# EAGLE design mLRS-E28-board01-v004 (EAGLE 7.5.0)
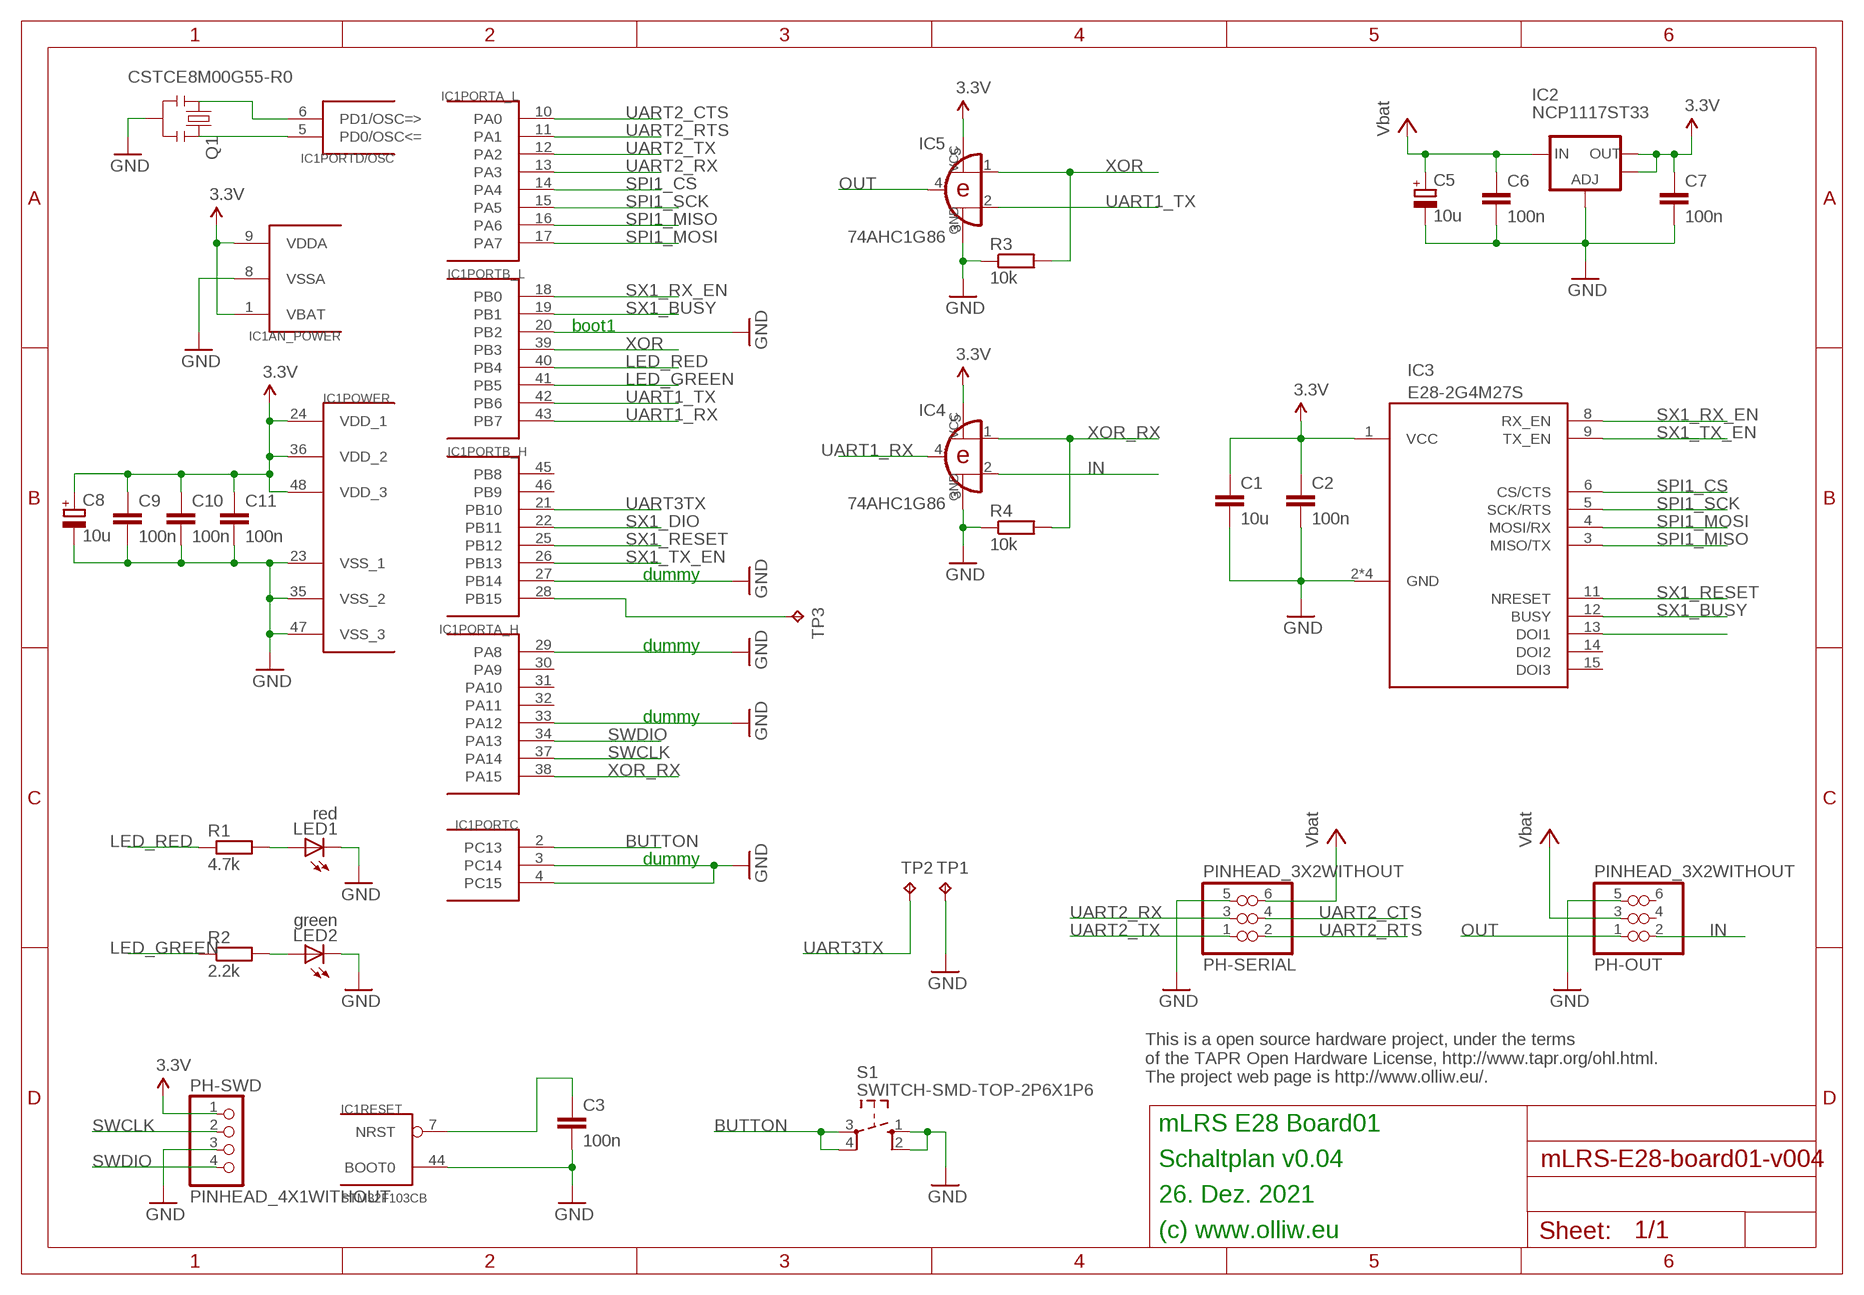
[diagram p0: schematic, sheet 1]

## Parts
C1  10u  C-EUC0603  [C0603]
C2  100n  C-EUC0402  [C0402]
C3  100n  C-EUC0603  [C0603]
C5  10u  CPOL-EUSMCA  [SMC_A]
C6  100n  C-EUC0603  [C0603]
C7  100n  C-EUC0603  [C0603]
C8  10u  CPOL-EUSMCA  [SMC_A]
C9  100n  C-EUC0603  [C0603]
C10  100n  C-EUC0603  [C0603]
C11  100n  C-EUC0603  [C0603]
IC1  STM32F103CB  STM32F10XCXT6  [TQFP48]
IC2  NCP1117ST33  V_REG_LM1117SOT223  [SOT223]
IC3  E28-2G4M27S  E28  [E28-2G4M27]
IC4  74AHC1G86  [SOT23-5-VER1]
IC5  74AHC1G86  [SOT23-5-VER1]
LED1  red  LEDCHIPLED_0603  [CHIPLED_0603]
LED2  green  LEDCHIPLED_0603  [CHIPLED_0603]
PH-OUT  PINHEAD_3X2WITHOUT  [PINHEAD_3X2_WO]
PH-SERIAL  PINHEAD_3X2WITHOUT  [PINHEAD_3X2_WO]
PH-SWD  PINHEAD_4X1WITHOUT  [PINHEAD_4X1_WO]
Q1  CSTCE8M00G55-R0  RESONATORSMD  [RESONATOR-SMD]
R1  4.7k  R-EU_R0402  [R0402]
R2  2.2k  R-EU_R0402  [R0402]
R3  10k  R-EU_R0402  [R0402]
R4  10k  R-EU_R0402  [R0402]
S1  SWITCH-SMD-TOP-2P6X1P6  [TACTILE-SWITCH-SMD-TOP-2P6X1X6]
TP1  TPB1,27  [B1,27]
TP2  TPB1,27  [B1,27]
TP3  TPTP08R  [TP08R]

## Nets
3.3V: C1.1 C2.1 C7.1 C8.+ C9.1 C10.1 C11.1 IC1.1(AN_POWER:VBAT) IC1.9(AN_POWER:VDDA) IC1.24(POWER:VDD_1) IC1.36(POWER:VDD_2) IC1.48(POWER:VDD_3) IC2.2(OUT) IC2.4(OUT) IC3.1(VCC) IC4.5(VCC) IC5.5(VCC) PH-SWD.1
BUTTON: IC1.2(PORTC:PC13) S1.3 S1.4
GND: C1.2 C2.2 C3.2 C5.- C6.2 C7.2 C8.- C9.2 C10.2 C11.2 IC1.3(PORTC:PC14) IC1.4(PORTC:PC15) IC1.8(AN_POWER:VSSA) IC1.20(PORTB_L:PB2) IC1.23(POWER:VSS_1) IC1.27(PORTB_H:PB14) IC1.29(PORTA_H:PA8) IC1.33(PORTA_H:PA12) IC1.35(POWER:VSS_2) IC1.44(RESET:BOOT0) IC1.47(POWER:VSS_3) IC2.1(ADJ) IC3.2(GND) IC3.7(GND) IC3.10(GND) IC3.16(GND) IC4.3(GND) IC5.3(GND) LED1.C LED2.C PH-OUT.5 PH-SERIAL.5 PH-SWD.3 Q1.2 R3.1 R4.1 S1.1 S1.2 TP1.TP
IN: IC4.2(I1) PH-OUT.2
LED_GREEN: IC1.41(PORTB_L:PB5) R2.1
LED_RED: IC1.40(PORTB_L:PB4) R1.1
N$5: C3.1 IC1.7(RESET:NRST)
N$9: IC1.28(PORTB_H:PB15) TP3.TP
N$12: IC1.5(PORTD/OSC:PD0/OSC<=) Q1.3
N$14: IC1.6(PORTD/OSC:PD1/OSC=>) Q1.1
N$17: LED1.A R1.2
N$19: LED2.A R2.2
OUT: IC5.4(O) PH-OUT.1
SPI1_CS: IC1.14(PORTA_L:PA4) IC3.6(CS/CTS)
SPI1_MISO: IC1.16(PORTA_L:PA6) IC3.3(MISO/TX)
SPI1_MOSI: IC1.17(PORTA_L:PA7) IC3.4(MOSI/RX)
SPI1_SCK: IC1.15(PORTA_L:PA5) IC3.5(SCK/RTS)
SWCLK: IC1.37(PORTA_H:PA14) PH-SWD.2
SWDIO: IC1.34(PORTA_H:PA13) PH-SWD.4
SX1_BUSY: IC1.19(PORTB_L:PB1) IC3.12(BUSY)
SX1_DIO: IC1.22(PORTB_H:PB11) IC3.13(DOI1)
SX1_RESET: IC1.25(PORTB_H:PB12) IC3.11(NRESET)
SX1_RX_EN: IC1.18(PORTB_L:PB0) IC3.8(RX_EN)
SX1_TX_EN: IC1.26(PORTB_H:PB13) IC3.9(TX_EN)
UART1_RX: IC1.43(PORTB_L:PB7) IC4.4(O)
UART1_TX: IC1.42(PORTB_L:PB6) IC5.2(I1)
UART2_CTS: IC1.10(PORTA_L:PA0) PH-SERIAL.4
UART2_RTS: IC1.11(PORTA_L:PA1) PH-SERIAL.2
UART2_RX: IC1.13(PORTA_L:PA3) PH-SERIAL.3
UART2_TX: IC1.12(PORTA_L:PA2) PH-SERIAL.1
UART3TX: IC1.21(PORTB_H:PB10) TP2.TP
VCC: C5.+ C6.1 IC2.3(IN) PH-OUT.3 PH-SERIAL.6 ; supply symbol labelled Vbat
XOR: IC1.39(PORTB_L:PB3) IC5.1(I0) R3.2
XOR_RX: IC1.38(PORTA_H:PA15) IC4.1(I0) R4.2
Unconnected: IC1.30(PORTA_H:PA9) IC1.31(PORTA_H:PA10) IC1.32(PORTA_H:PA11) IC1.45(PORTB_H:PB8) IC1.46(PORTB_H:PB9) IC3.14(DOI2) IC3.15(DOI3) PH-OUT.4 PH-OUT.6

## Notes on the sheet
- boot1
- dummy
- dummy
- dummy
- dummy
- This is a open source hardware project, under the terms
  of the TAPR Open Hardware License, http://www.tapr.org/ohl.html.
  The project web page is http://www.olliw.eu/.
- mLRS E28 Board01
- Schaltplan v0.04
- 26. Dez. 2021
- (c) www.olliw.eu

## Library data of the parts
C1-C3 C6 C7 C9-C11 = rcl:C-EU: CAPACITOR, European symbol
C5 C8 = rcl:CPOL-EU: POLARIZED CAPACITOR, European symbol
IC1 = # stm32:STM32F10XCXT6: ST STM32F101/103 48pin LQFP
IC2 = # SparkFun2:V_REG_LM1117: Voltage Regulator LM1117 Standard adjustable voltage regulator but in SMD form. Spark Fun Electronics SKU : COM-00595
IC3 = # stdlib:E28
IC4 IC5 = # stdlib:74AHC1G86
LED1 LED2 = led:LED: LED OSRAM: - CHIPLED LG R971, LG N971, LY N971, LG Q971, LY Q971, LO R971, LY R971 LH N974, LH R974 LS Q976, LO Q976, LY Q976 LO Q996 - Hyper CHIPLED LW Q18S LB Q993, LB Q99A, LB R99A - SideLED LS A670, LO A670, LY A670, LG A670, LP A670 LB A673, LV A673, LT A673, LW A673 LH A674 LY A675 LS A676, LA A676, LO A676, LY A676, LW A676 LS A679, LY A679, LG A679 - Hyper Micro SIDELED® LS Y876, LA Y876, LO Y876, LY Y876 LT Y87S - SmartLED LW L88C, LW L88S LB L89C, LB L89S, LG L890 LS L89K, LO L89K, LY L89K LS L896, LA L896, LO L896, LY L896 - TOPLED LS T670, LO T670, LY T670, LG T670, LP T670 LSG T670, LSP T670, LSY T670, LOP T670, LYG T670 LG T671, LOG T671, LSG T671 LB T673, LV T673, LT T673, LW T673 LH T674 LS T676, LA T676, LO T676, LY T676, LB T676, LH T676, LSB T676, LW T676 LB T67C, LV T67C, LT T67C, LS T67K, LO T67K, LY T67K, LW E67C LS E67B, LA E67B, LO E67B, LY E67B, LB E67C, LV E67C, LT E67C LW T67C LS T679, LY T679, LG T679 LS T770, LO T770, LY T770, LG T770, LP T770 LB T773, LV T773, LT T773, LW T773 LH T774 LS E675, LA E675, LY E675, LS T675 LS T776, LA T776, LO T776, LY T776, LB T776 LHGB T686 LT T68C, LB T68C - Hyper Mini TOPLED® LB M676 - Mini TOPLED Santana® LG M470 LS M47K, LO M47K, LY M47K Source: http://www.osram.convergy.de LUXEON: - LUMILED® LXK2-PW12-R00, LXK2-PW12-S00, LXK2-PW14-U00, LXK2-PW14-V00 LXK2-PM12-R00, LXK2-PM12-S00, LXK2-PM14-U00 LXK2-PE12-Q00, LXK2-PE12-R00, LXK2-PE12-S00, LXK2-PE14-T00, LXK2-PE14-U00 LXK2-PB12-K00, LXK2-PB12-L00, LXK2-PB12-M00, LXK2-PB14-N00, LXK2-PB14-P00, LXK2-PB14-Q00 LXK2-PR12-L00, LXK2-PR12-M00, LXK2-PR14-Q00, LXK2-PR14-R00 LXK2-PD12-Q00, LXK2-PD12-R00, LXK2-PD12-S00 LXK2-PH12-R00, LXK2-PH12-S00 LXK2-PL12-P00, LXK2-PL12-Q00, LXK2-PL12-R00 Source: www.luxeon.com KINGBRIGHT: KA-3528ASYC Source: www.kingbright.com
PH-OUT PH-SERIAL = # stdlib:PINHEAD_3X2
PH-SWD = # stdlib:PINHEAD_4X1
Q1 = # SparkFun2:RESONATOR: Resonator Small SMD resonator. This is the itty bitty 10/20MHz resonators with built in caps. CSTCE10M0G55 and CSTCE20M0V53. Footprint has been reviewed closely but hasn't been tested yet.
R1-R4 = rcl:R-EU_: RESISTOR, European symbol
S1 = # stdlib:SWITCH-SMD-TOP-2P6X1P6
TP1-TP3 = testpad:TP: Test pad

## Board
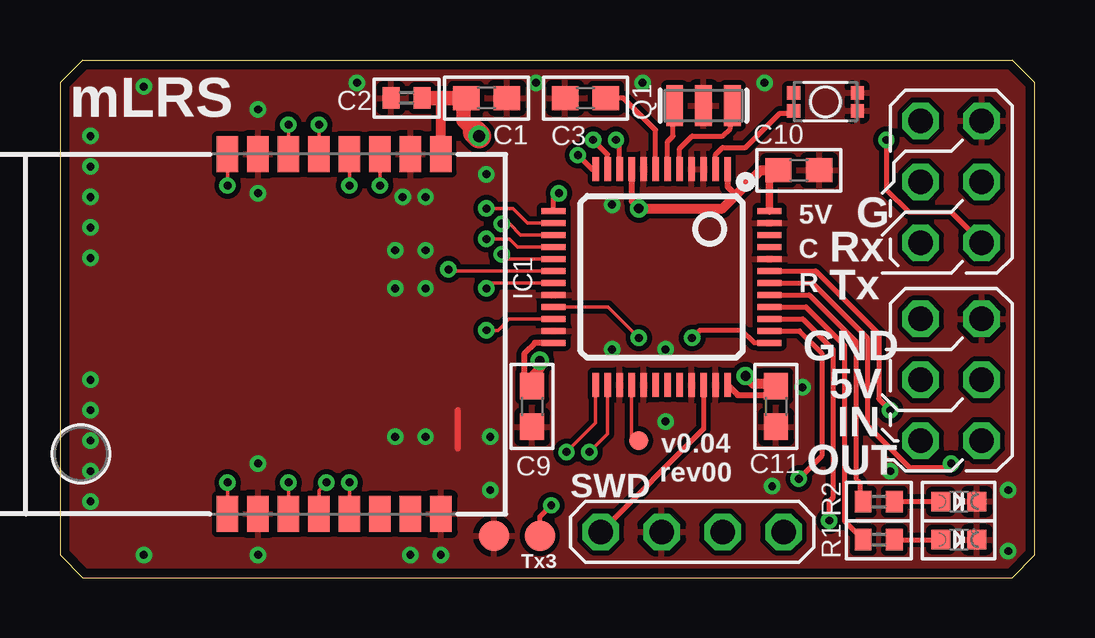
[diagram p1: board, top side]
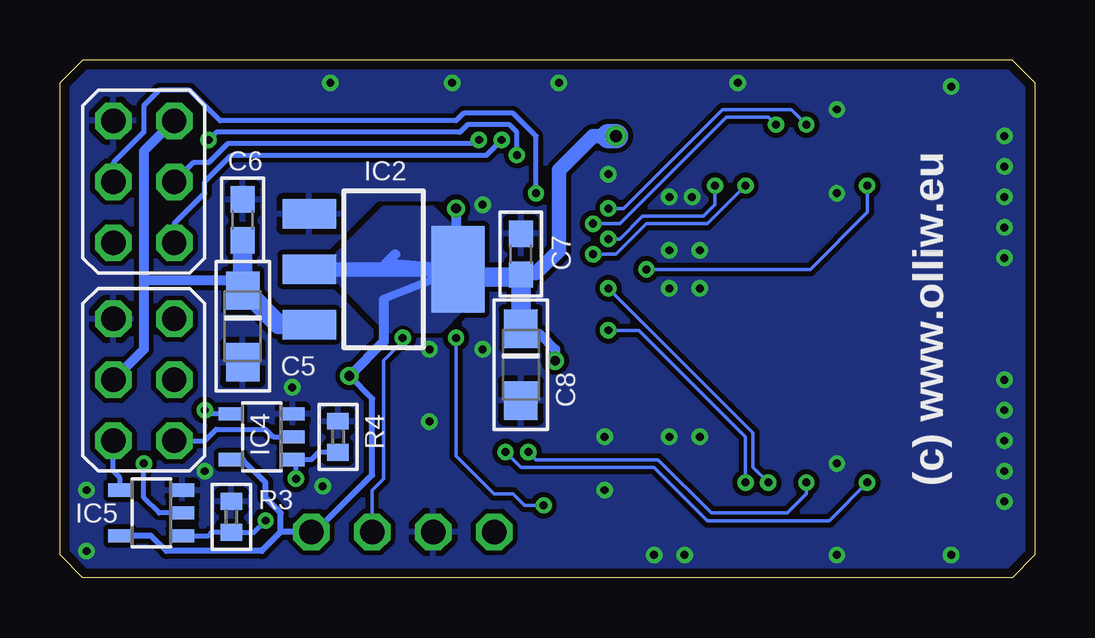
[diagram p2: board, bottom side, seen from below]

Size 40.64 x 21.59 mm. Coordinates in mm from the lower left corner, seen from the top.
Outline: 39.69,0 40.64,0.95 40.64,20.64 39.69,21.59 0.95,21.59 0,20.64 0,0.95 0.95,0 39.69,0
Copper layers (1*16): Top 0.0356mm / dielectric 1.5011mm / Bottom 0.0356mm
Design rules "ow-oshpark-2layer": minimum track width 6mil, minimum drill 13mil, track to track 6mil, track to pad 6mil, pad to pad 6mil, via to via 6mil, smd to smd 6mil, copper to edge 15mil, drill to drill 6mil, minimum pad ring 7mil, minimum via ring 7mil, stop-mask expansion 2.5mil, vias tented up to drill 26mil, thermal gap 10mil

### Footprints (pad centres in the part's own frame; a part is rotated, then mirrored left to right if it is on the bottom)
C0603 = smd 1.1 x 1: 1 -0.85,0; 2 0.85,0
C0402 = smd 0.7 x 0.9: 1 -0.65,0; 2 0.65,0
SMC_A = smd 1.6 x 1.4: + -1.5,0; - 1.5,0
TQFP48 = smd 0.254 x 1: 1 -2.75,-4.5; 2 -2.25,-4.5; 3 -1.75,-4.5; 4 -1.25,-4.5; 5 -0.75,-4.5; 6 -0.25,-4.5; 7 0.25,-4.5; 8 0.75,-4.5; 9 1.25,-4.5; 10 1.75,-4.5; 11 2.25,-4.5; 12 2.75,-4.5; 25 2.75,4.5; 26 2.25,4.5; 27 1.75,4.5; 28 1.25,4.5; 29 0.75,4.5; 30 0.25,4.5; 31 -0.25,4.5; 32 -0.75,4.5; 33 -1.25,4.5; 34 -1.75,4.5; 35 -2.25,4.5; 36 -2.75,4.5 | smd 1 x 0.254: 13 4.5,-2.75; 14 4.5,-2.25; 15 4.5,-1.75; 16 4.5,-1.25; 17 4.5,-0.75; 18 4.5,-0.25; 19 4.5,0.25; 20 4.5,0.75; 21 4.5,1.25; 22 4.5,1.75; 23 4.5,2.25; 24 4.5,2.75; 37 -4.5,2.75; 38 -4.5,2.25; 39 -4.5,1.75; 40 -4.5,1.25; 41 -4.5,0.75; 42 -4.5,0.25; 43 -4.5,-0.25; 44 -4.5,-0.75; 45 -4.5,-1.25; 46 -4.5,-1.75; 47 -4.5,-2.25; 48 -4.5,-2.75
SOT223 = smd 1.219 x 2.235: 1 -2.311,-3.099; 2 0,-3.099; 3 2.311,-3.099 | smd 3.6 x 2.2: 4 0,3.099
E28-2G4M27 = smd 1.5 x 0.9: 1 7.5,0; 2 7.5,1.27; 3 7.5,2.54; 4 7.5,3.81; 5 7.5,5.08; 6 7.5,6.35; 7 7.5,7.62; 8 7.5,8.89; 9 -7.5,8.89; 10 -7.5,7.62; 11 -7.5,6.35; 12 -7.5,5.08; 13 -7.5,3.81; 14 -7.5,2.54; 15 -7.5,1.27; 16 -7.5,0
SOT23-5-VER1 = smd 0.55 x 0.99: 1 -0.95,-1.29; 2 0,-1.29; 3 0.95,-1.29; 4 0.95,1.3; 5 -0.95,1.3
CHIPLED_0603 = smd 0.8 x 0.8: A 0,-0.75; C 0,0.75
PINHEAD_3X2_WO = drill 1.016 octagon: 1 0,0; 2 2.54,0; 3 0,-2.54; 4 2.54,-2.54; 5 0,-5.08; 6 2.54,-5.08
PINHEAD_4X1_WO = drill 1.016 octagon: 1 0,0; 2 0,-2.54; 3 0,-5.08; 4 0,-7.62
RESONATOR-SMD = smd 0.7 x 1.7: 1 -1.2,0; 2 0,0; 3 1.2,0
R0402 = smd 0.7 x 0.9: 1 -0.65,0; 2 0.65,0
TACTILE-SWITCH-SMD-TOP-2P6X1X6 = smd 0.55 x 0.55: 1 -1.325,0.375; 2 -1.325,-0.375; 3 1.325,-0.375; 4 1.325,0.375
B1,27 = smd 1.27 x 1.27: TP 0,0
TP08R = smd 0.8 x 0.8: TP 0,0

### Placement (x,y rotation side)
C1  17.78,20 0 top
C2  14.45,20 180 top
C3  21.91,20 180 top
C5  33.02,10.48 270 bottom
C6  33.02,14.92 90 bottom
C7  21.43,13.49 90 bottom
C8  21.43,8.89 270 bottom
C9  19.69,7.14 270 top
C10  30.8,16.99 0 top
C11  29.85,7.14 270 top
IC1  25.08,12.54 180 top
IC2  27.15,12.86 270 bottom
IC3  15.87,10.16 90 top
IC4  32.23,5.87 90 bottom
IC5  36.83,2.7 90 bottom
LED1  37.46,1.59 270 top
LED2  37.46,3.18 270 top
PH-OUT  38.42,5.71 180 top
PH-SERIAL  38.42,13.97 180 top
PH-SWD  30.16,1.9 270 top
Q1  26.83,19.69 0 top
R1  34.13,1.59 0 top
R2  34.13,3.18 0 top
R3  33.5,2.54 270 bottom
R4  29.05,5.87 270 bottom
S1  31.91,19.84 180 top
TP1  18.1,1.75 0 top
TP2  20,1.75 0 top
TP3  24.13,5.71 0 top

### Tracks (layer width: path | path; a pad name or v marks a point on that pad's centre or on a via)
3.3V  (via drill 0.4, 0.5)
  Top 0.254: IC1.36 28.26,7.62 29.58,7.62 | IC1.24 19.79,9.79 19.37,9.37 19.37,8.25 19.63,8.15 C9.1 | IC1.9 23.83,15.7 v24.13,15.4 | IC1.1 27.83,16.3 28.18,15.95
  Top 0.305: 29.58,7.62 C11.1 29.58,8.1 | IC1.48 29.58,16.94 C10.1 | 19.53,8.25 19.63,8.1 C9.1
  Top 0.406: v24.13,15.4 27.62,15.4 28.18,15.95 29.21,16.99 C10.1 | v28.57,8.41 28.89,8.1 29.58,8.1 | v20,9.05 20,8.73 19.53,8.25 | IC3.1 15.87,19.84 15.4,20
  Top 0.61: C2.1 15.4,20 C1.1 16.83,19.9 16.83,19.05 17.3,18.57
  Top 1.016: 17.3,18.57 v17.46,18.42
  Bottom 0.203: 37.97,1.75 IC5.5
  Bottom 0.254: v28.57,8.41 27.62,7.46 27.62,4.29 30,1.9 PH-SWD.1 31.43,1.9 | 31.43,1.9 32.23,1.11 36.2,1.11 36.83,1.75 37.97,1.75 | 31.43,1.9 31.43,2.7 32.07,3.33 32.07,3.97 33.02,4.92 33.84,4.92 IC4.5
  Bottom 0.305: IC2.4 27.06,11.67 27.15,11.59
  Bottom 0.406: 26.67,13.49 27.06,13.1 IC2.4 24.13,12.94 v24.13,15.4 | 27.15,11.59 27.15,9.84 v28.57,8.41 | v20,9.05 20,9.53 20.64,10.16 21.34,10.16 C8.+ | 21.38,12.7 C7.1
  Bottom 0.61: IC2.2 IC2.4 | 21.38,12.7 20.8,12.7 19.84,13.65 19.84,16.99 18.42,18.42 17.78,18.42
  Bottom 0.813: 21.43,12.54 C8.+ | C7.1 21.43,12.54 | 21.43,12.54 23.89,12.54 IC2.4
  Bottom 1.016: 17.78,18.42 v17.46,18.42
  pour Bottom (no thermals): 23.97,11.11 24.29,14.6 25.08,15.4 27.15,15.4 29.21,13.33 29.21,12.38 29.05,12.38 26.99,10.32 24.77,10.32
BUTTON
  Top 0.152: S1.3 S1.4
  Top 0.203: IC1.2 27.33,17.65 27.62,17.94 28.57,17.94 30,19.37 30.48,19.37 S1.4
GND  (via drill 0.33)
  Top 0.254: 16.59,5.39 16.59,6.98
  other vias: 1.27,18.42 1.27,3.18 39.53,1.11 39.53,3.65 14.29,15.87 12.38,20.64 19.84,20.64 15.24,15.87 13.97,13.65 15.24,13.65 13.97,12.06 15.24,12.06 13.97,5.87 15.24,5.87 15.87,0.95 14.6,0.95 8.25,0.95 8.25,4.76 8.25,16.03 8.25,19.53 34.61,4.45 23.02,15.56 23.02,9.53 25.24,9.53 30.96,7.94 24.29,20.64 29.37,20.64 25.24,6.51 17.94,5.87 17.94,3.65 29.69,3.81 1.27,4.45 1.27,5.71 1.27,6.98 1.27,8.25 1.27,17.14 1.27,15.87 1.27,14.6 1.27,13.33 3.49,20.48 3.49,0.95 17.78,16.83
  pour Bottom (isolate 0.203, rank 6): 0.32,21.27 40.32,21.27 40.32,0.32 0.32,0.32
  pour Top (isolate 0.203, rank 6): 0.32,21.27 40.32,21.27 40.32,0.32 0.32,0.32
IN
  Bottom 0.203: PH-OUT.2 34.61,5.71 34.13,6.19 32.07,6.19 31.75,5.87 IC4.2
LED_GREEN
  Top 0.203: IC1.41 31.23,11.79 33.18,9.84 33.18,4.13 33.34,3.97 33.34,3.32 R2.1
LED_RED
  Top 0.203: R1.1 32.7,2.37 32.7,9.68 31.1,11.29 IC1.40
N$5
  Top 0.203: IC1.7 24.83,18.67 23.5,20 C3.1
N$9
  Top 0.152: IC1.28 23.83,5.89 TP3.TP
N$12
  Top 0.203: IC1.5 25.83,17.89 26.35,18.42 27.62,18.42 27.94,18.73 27.94,19.6 Q1.3
N$14
  Top 0.203: IC1.6 25.33,18.19 25.56,18.42 25.56,19.62 Q1.1
N$17
  Top 0.203: R1.2 LED1.A
N$19
  Top 0.203: R2.2 LED2.A
OUT
  Bottom 0.203: IC5.4 38.13,4.16 38.42,4.45 PH-OUT.1
SPI1_CS  (via drill 0.33)
  Top 0.152: IC1.14 19.5,14.79 18.89,15.4 v17.78,15.4 | IC3.6 v9.53,18.89
  Bottom 0.152: v9.53,18.89 10.16,19.53 13.02,19.53 17.14,15.4 v17.78,15.4
SPI1_MISO  (via drill 0.33)
  Top 0.152: IC1.16 19.07,13.79 18.73,14.13 v17.78,14.13 | IC3.3 v13.33,16.35
  Bottom 0.152: v17.78,14.13 17.3,14.13 16.35,15.08 13.81,15.08 13.33,15.56 v13.33,16.35
SPI1_MOSI  (via drill 0.33)
  Top 0.152: IC1.17 18.62,13.29 v18.42,13.49 | IC3.4 v12.06,16.35
  Bottom 0.152: v18.42,13.49 17.46,13.49 16.19,14.76 13.65,14.76 v12.06,16.35
SPI1_SCK  (via drill 0.33)
  Top 0.152: IC1.15 19.21,14.29 18.73,14.76 v18.42,14.76 | IC3.5 v10.79,18.89
  Bottom 0.152: v10.79,18.89 11.11,19.21 12.86,19.21 17.3,14.76 v18.42,14.76
SWCLK  (via drill 0.33)
  Top 0.203: IC1.37 28.94,9.79 28.42,10.32 26.67,10.32 v26.35,10
  Bottom 0.152: v26.35,10 26.35,9.84 27.15,9.05 27.15,4.13 27.62,3.65 PH-SWD.2
SWDIO
  Top 0.203: IC1.34 26.83,6.2 PH-SWD.4
SX1_BUSY  (via drill 0.33)
  Top 0.152: IC1.19 18.01,12.29 v17.78,12.06 | v11.11,3.97 10.79,3.65 IC3.12
  Bottom 0.152: v17.78,12.06 11.75,6.03 11.75,4.6 v11.11,3.97
SX1_DIO  (via drill 0.33)
  Top 0.152: v12.06,3.97 IC3.13 | IC1.22 18.73,10.79 18.26,10.32 v17.78,10.32
  Bottom 0.152: v12.06,3.97 12.06,5.87 16.51,10.32 v17.78,10.32
SX1_RESET  (via drill 0.33)
  Top 0.152: v9.53,3.97 IC3.11 | IC1.25 22.33,6.46 v21.11,5.24
  Bottom 0.152: v9.53,3.97 9.53,3.49 10.32,2.7 13.49,2.7 15.72,4.92 20.8,4.92 v21.11,5.24
SX1_RX_EN  (via drill 0.33)
  Top 0.152: IC1.18 16.26,12.79 v16.19,12.86 | v6.98,16.35 IC3.8
  Bottom 0.152: v16.19,12.86 9.37,12.86 6.98,15.24 v6.98,16.35
SX1_TX_EN  (via drill 0.33)
  Top 0.152: IC1.26 22.83,6 v22.07,5.24 | v6.98,3.97 IC3.9
  Bottom 0.152: v22.07,5.24 21.43,4.6 15.87,4.6 13.65,2.38 8.57,2.38 v6.98,3.97
UART1_RX  (via drill 0.33)
  Top 0.203: IC1.43 31.5,12.79 34.13,10.16 34.13,7.46 v34.61,6.98
  Bottom 0.203: IC4.4 34.45,6.82 v34.61,6.98
UART1_TX  (via drill 0.33)
  Top 0.203: IC1.42 31.36,12.29 33.66,10 33.66,6.35 35.4,4.6 36.99,4.6 v37.15,4.76
  Bottom 0.203: IC5.2 36.51,2.7 37.15,3.33 v37.15,4.76
UART2_CTS  (via drill 0.33)
  Top 0.203: IC1.10 23.33,18.1 v23.18,18.26
  Bottom 0.203: v23.18,18.26 23.34,18.1 33.66,18.1 34.45,17.3 35.08,17.3 PH-SERIAL.4
UART2_RTS  (via drill 0.33)
  Top 0.203: IC1.11 22.83,17.65 v22.23,18.26
  Bottom 0.203: v22.23,18.26 22.86,17.62 33.5,17.62 34.61,16.51 34.61,16.03 35.88,14.76 PH-SERIAL.2
UART2_RX  (via drill 0.33)
  Top 0.203: IC1.13 20.58,15.82 v20.8,16.03
  Bottom 0.203: v20.8,16.03 20.8,18.42 21.75,19.37 23.81,19.37 24.13,19.05 33.97,19.05 35.24,20.32 36.51,20.32 37.15,19.69 37.15,18.57 38.42,17.3 PH-SERIAL.3
UART2_TX  (via drill 0.33)
  Top 0.152: IC1.12
  Top 0.203: v34.45,18.26 34.45,16.19 35.4,15.24 37.15,15.24 PH-SERIAL.1 | IC1.12 22.17,17.04 v21.59,17.62
  Bottom 0.203: v21.59,17.62 21.59,18.57 21.91,18.89 23.65,18.89 23.97,18.57 34.13,18.57 v34.45,18.26
UART3TX  (via drill 0.33)
  Top 0.152: IC1.21 22.84,11.29 v24.13,10
  Top 0.203: TP2.TP 20,2.54 v20.48,3.02
  Bottom 0.152: v24.13,10 24.13,5.08 22.54,3.49 21.75,3.49 21.27,3.02 v20.48,3.02
VCC
  Bottom 0.406: 37.15,12.38 37.15,17.78 PH-SERIAL.6 | 37.15,12.38 37.15,9.53 PH-OUT.3 | 37.15,12.38 33.42,12.38 C5.+
  Bottom 0.813: IC2.3 31.52,10.56 32.7,11.75 32.79,11.75 C5.+ C6.1
XOR  (via drill 0.33)
  Top 0.203: v32.07,2.38 32.07,3.18 32.23,3.33 32.23,9.53 30.96,10.79 IC1.39
  Bottom 0.203: v32.07,2.38 32.56,1.89 R3.2 33.19,1.9 34.29,1.9 34.45,1.75 IC5.1
XOR_RX  (via drill 0.33)
  Top 0.203: IC1.38 30.82,10.29 31.75,9.37 31.75,5.08 v30.8,4.13
  Bottom 0.203: R4.2 29.86,5.22 30.16,4.92 IC4.1 30.8,4.74 v30.8,4.13

### Text on the board
tNames: mLRS | 5V | G | C | Rx | R | Tx | GND | 5V | v0.04 / rev00 | IN | OUT | SWD | Tx3
bNames: (c) www.olliw.eu